# EAGLE design morse radio v1 (EAGLE 9.3.0)
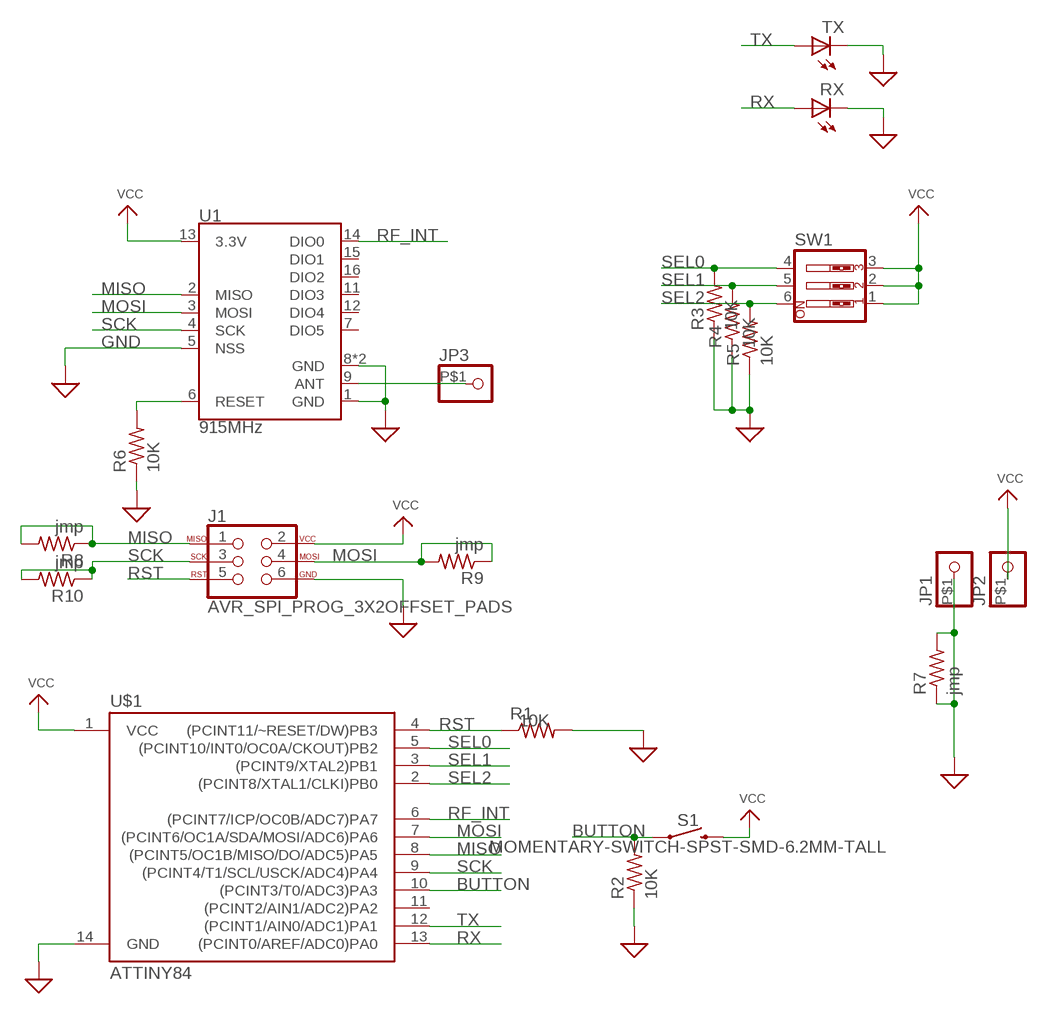
[diagram p0: schematic, sheet 1]

## Parts
J1  AVR_SPI_PROG_3X2OFFSET_PADS  [2X3_OFFSET]
JP1  PINHD-1X1-BIGPOGO  [1X1-BIGPOGO]
JP2  PINHD-1X1-BIGPOGO  [1X1-BIGPOGO]
JP3  PINHD-1X1-BIGPOGO  [1X1-BIGPOGO]
R1  10K  R-US_M1206  [M1206]
R2  10K  R-US_M1206  [M1206]
R3  10K  R-US_M1206  [M1206]
R4  10K  R-US_M1206  [M1206]
R5  10K  R-US_M1206  [M1206]
R6  10K  R-US_M1206  [M1206]
R7  jmp  R-US_M1206  [M1206]
R8  jmp  R-US_M1206  [M1206]
R9  jmp  R-US_M1206  [M1206]
R10  jmp  R-US_M1206  [M1206]
RX  LEDSMT1206  [1206]
S1  MOMENTARY-SWITCH-SPST-SMD-6.2MM-TALL  [TACTILE_SWITCH_SMD_6.2MM_TALL]
SW1  SW_DIP-3  [EDG-03]
TX  LEDSMT1206  [1206]
U1  915MHz  RFM69HCW-915  [RFM69HCW-XXXS2]
U$1  ATTINY84  [SO14]

## Nets
BUTTON: R2.2 S1.A2 U$1.10((PCINT3/T0/ADC3)PA3)
GND: J1.6 JP1.P$1 R1.2 R2.1 R3.1 R4.1 R5.1 R6.1 R7.1 R7.2 RX.C TX.C U1.1(GND) U1.5(NSS) U1.8(GND) U1.10(GND) U$1.14(GND) ; supply symbol labelled SUP
MISO: J1.1 R8.1 R8.2 U1.2(MISO) U$1.8((PCINT5/OC1B/MISO/DO/ADC5)PA5)
MOSI: J1.4 R9.1 R9.2 U1.3(MOSI) U$1.7((PCINT6/OC1A/SDA/MOSI/ADC6)PA6)
N$1: JP3.P$1 U1.9(ANT)
N$2: R6.2 U1.6(RESET)
RF_INT: U1.14(DIO0) U$1.6((PCINT7/ICP/OC0B/ADC7)PA7)
RST: J1.5 R1.1 U$1.4((PCINT11/~RESET/DW)PB3)
RX: RX.A U$1.13((PCINT0/AREF/ADC0)PA0)
SCK: J1.3 R10.1 R10.2 U1.4(SCK) U$1.9((PCINT4/T1/SCL/USCK/ADC4)PA4)
SEL0: R3.2 SW1.4 U$1.5((PCINT10/INT0/OC0A/CKOUT)PB2)
SEL1: R4.2 SW1.5 U$1.3((PCINT9/XTAL2)PB1)
SEL2: R5.2 SW1.6 U$1.2((PCINT8/XTAL1/CLKI)PB0)
TX: TX.A U$1.12((PCINT1/AIN0/ADC1)PA1)
VCC: J1.2 JP2.P$1 S1.B2 SW1.1 SW1.2 SW1.3 U1.13(3.3V) U$1.1(VCC)
Unconnected: U1.7(DIO5) U1.11(DIO3) U1.12(DIO4) U1.15(DIO1) U1.16(DIO2) U$1.11((PCINT2/AIN1/ADC2)PA2)

## Library data of the parts
J1 = SparkFun-Connectors:AVR_SPI_PROG_3X2: AVR ISP 6 Pin This is the reduced ISP connector for AVR programming. Common on Arduino. This footprint will take up less PCB space and can be used with a 10-pin to 6-pin adapter such as SKU: BOB-08508 **Special note about "TEST_POINT" package. The stop mask is on the top side, so if you want your programming test points to be on the bottom of your board, make sure to place this package on the bottom side of the board. This also ensure that the orientation to program from the bottom side will be correct. SparkFun Products: SparkFun ISP Pogo Adapter <https://www.sparkfun.com/products/11591> - NS Tiny AVR Programmer <https://www.sparkfun.com/products/11801> -PTH
JP1-JP3 = adafruit:PINHD-1X1: Pin header 1x1 for 0.1" spacing With round pins
R1-R10 = adafruit:R-US_: RESISTOR, American symbol
RX TX = adafruit:LED: LED OSRAM: - CHIPLED LG R971, LG N971, LY N971, LG Q971, LY Q971, LO R971, LY R971 LH N974, LH R974 LS Q976, LO Q976, LY Q976 LO Q996 - Hyper CHIPLED LW Q18S LB Q993, LB Q99A, LB R99A - SideLED LS A670, LO A670, LY A670, LG A670, LP A670 LB A673, LV A673, LT A673, LW A673 LH A674 LY A675 LS A676, LA A676, LO A676, LY A676, LW A676 LS A679, LY A679, LG A679 - Hyper Micro SIDELED® LS Y876, LA Y876, LO Y876, LY Y876 LT Y87S - SmartLED LW L88C, LW L88S LB L89C, LB L89S, LG L890 LS L89K, LO L89K, LY L89K LS L896, LA L896, LO L896, LY L896 - TOPLED LS T670, LO T670, LY T670, LG T670, LP T670 LSG T670, LSP T670, LSY T670, LOP T670, LYG T670 LG T671, LOG T671, LSG T671 LB T673, LV T673, LT T673, LW T673 LH T674 LS T676, LA T676, LO T676, LY T676, LB T676, LH T676, LSB T676, LW T676 LB T67C, LV T67C, LT T67C, LS T67K, LO T67K, LY T67K, LW E67C LS E67B, LA E67B, LO E67B, LY E67B, LB E67C, LV E67C, LT E67C LW T67C LS T679, LY T679, LG T679 LS T770, LO T770, LY T770, LG T770, LP T770 LB T773, LV T773, LT T773, LW T773 LH T774 LS E675, LA E675, LY E675, LS T675 LS T776, LA T776, LO T776, LY T776, LB T776 LHGB T686 LT T68C, LB T68C - Hyper Mini TOPLED® LB M676 - Mini TOPLED Santana® LG M470 LS M47K, LO M47K, LY M47K Source: http://www.osram.convergy.de/
S1 = SparkFun-Switches:MOMENTARY-SWITCH-SPST: Momentary Switch (Pushbutton) - SPST Normally-open (NO) SPST momentary switches (buttons, pushbuttons). Variants PTH-12MM - 12mm square, through-hole Momentary Pushbutton Switch - 12mm Square <https://www.sparkfun.com/products/9190> (COM-09190) PTH-6.0MM, PTH-6.0MM-KIT - 6.0mm square, through-hole Mini Pushbutton Switch <https://www.sparkfun.com/products/97> (COM-00097) KIT package intended for soldering kit's - only one side of pads' copper is exposed. PTH-RIGHT-ANGLE-KIT - Right-angle, through-hole Right Angle Tactile Button <https://www.sparkfun.com/products/10791> - Used on SparkFun BigTime Watch Kit <https://www.sparkfun.com/products/11734> SMD-12MM - 12mm square, surface-mount Tactile Button - SMD (12mm) <https://www.sparkfun.com/products/12993> (COM-12993) Used on SparkFun PicoBoard <https://www.sparkfun.com/products/11888> SMD-4.5MM - 4.5mm Square Trackball Switch Used on SparkFun Blackberry Trackballer Breakout <https://www.sparkfun.com/products/13169> SMD-4.6MMX2.8MM - 4.60mm x 2.80mm, surface mount Used on SparkFun SAMD21 Mini Breakout <https://www.sparkfun.com/products/13664> SMD-5.2MM, SMD-5.2-REDUNDANT - 5.2mm square, surface-mount Mini Pushbutton Switch - SMD <https://www.sparkfun.com/products/8720> (COM-08720) Used on Arduino Pro Mini <https://www.sparkfun.com/products/11114> REDUNDANT package connects both switch circuits together SMD-6.0X3.5MM - 6.0 x 3.5mm, surface mount Momentary Reset Switch SMD <https://www.sparkfun.com/products/8229> (COM-08229) SMD-6.2MM-TALL - 6.2mm square, surface mount Tactile Button - SMD (6mm) <https://www.sparkfun.com/products/12992> Used on SparkFun Digital Sandbox <https://www.sparkfun.com/products/12651> SMD-RIGHT-ANGLE - Right-angle, surface mount Used on SparkFun Block for Intel® Edison - Arduino <https://www.sparkfun.com/products/13036>; PROD_ID: SWCH-11966; SF_SKU: COM-12992
SW1 = special:SW_DIP-3: DIP SWITCH
U1 = SparkFun-RF:RFM69H: Hope RF RFM69H ISM Transceiver Module The RFM69H is a transceiver module capable of operation over a wide frequency range, including the 315,433,868 and 915MHz license-free ISM (Industry Scientific and Medical) frequency bands. All major RF communication parameters are programmable and most of them can be dynamically set. The RFM69H offers the unique advantage of programmable narrow-band and wide- band communication modes. The RFM69H is optimized for low power consumption while offering high RF output power and channelized operation.Compliance ETSI and FCC regulations. Datasheet <http://www.hoperf.cn/upload/docs/RF/SX/RFM69H_DataSheet_v1.3.pdf> SparkFun Products RFM69HCW Wireless Transceiver - 915MHz <https://www.sparkfun.com/products/13909> (COM-13909) RFM69HCW Wireless Transceiver - 434MHz <https://www.sparkfun.com/products/13910> (COM-13910) SparkFun RFM69 Breakout (915MHz) <https://www.sparkfun.com/products/12775> (WRL-12775) SparkFun RFM69 Breakout (434MHz) <https://www.sparkfun.com/products/12823> (WRL-12823); PROD_ID: IC-11997
U$1 = SparkFun-IC-Microcontroller:ATTINY84: Atmel 14-pin 2/4/8kB flash uC Datasheet <https://cdn.sparkfun.com/datasheets/Widgets/doc8006.pdf> SparkFun Products Tiny AVR Programmer <https://www.sparkfun.com/products/11801> (PGM-11801) SparkFun Servo Trigger - Continuous Rotation <https://www.sparkfun.com/products/13872> (WIG-13872) SparkFun Servo Trigger <https://www.sparkfun.com/products/13118> (WIG-13118); PROD_ID: IC-11285

## Board
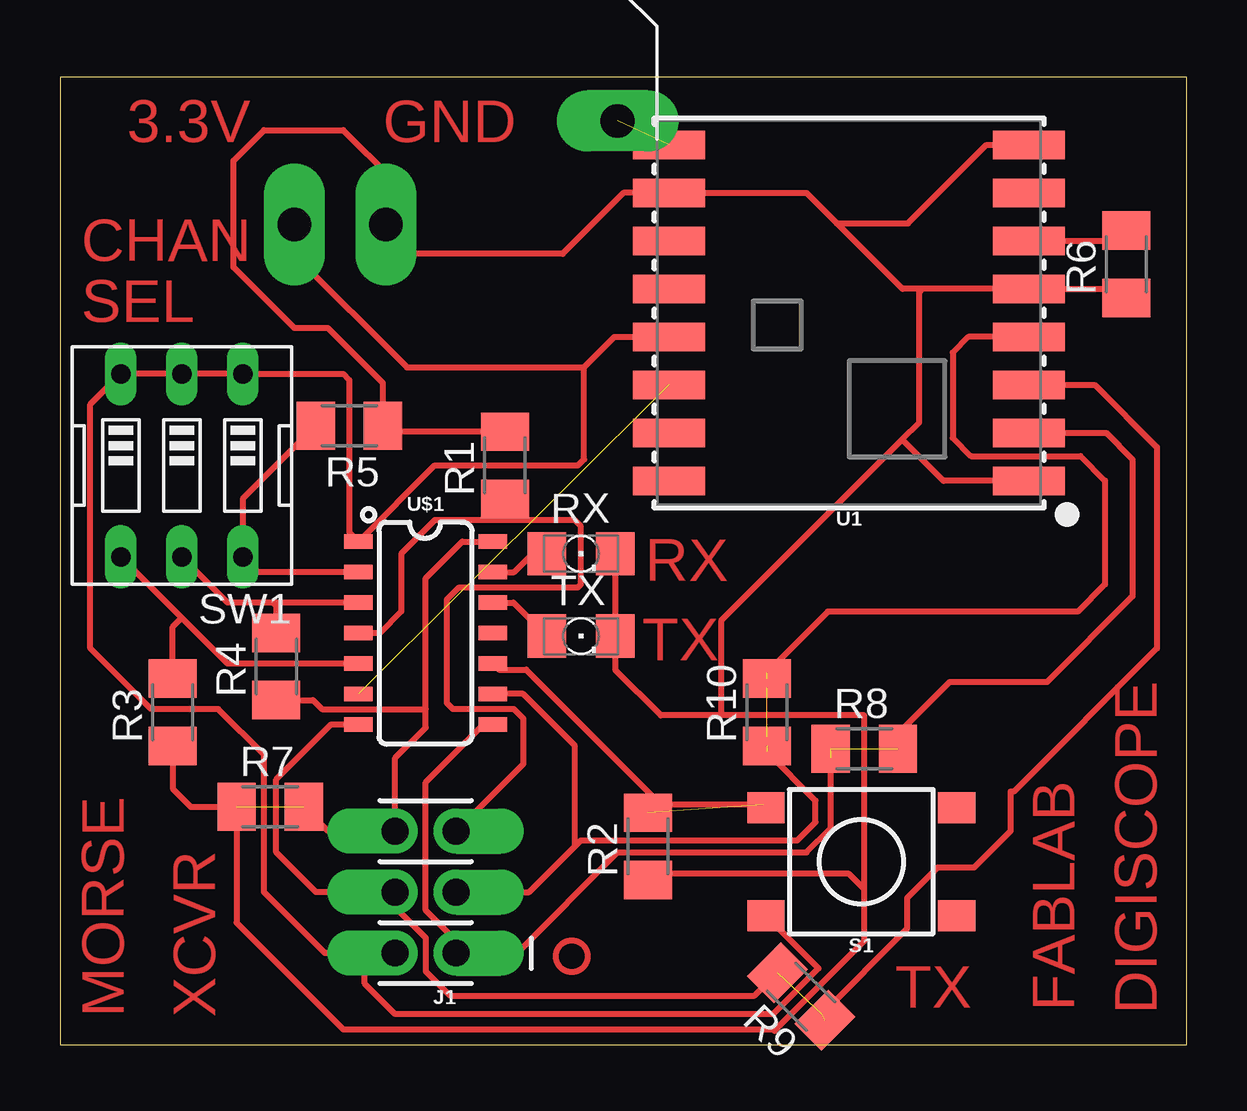
[diagram p1: board, top side]
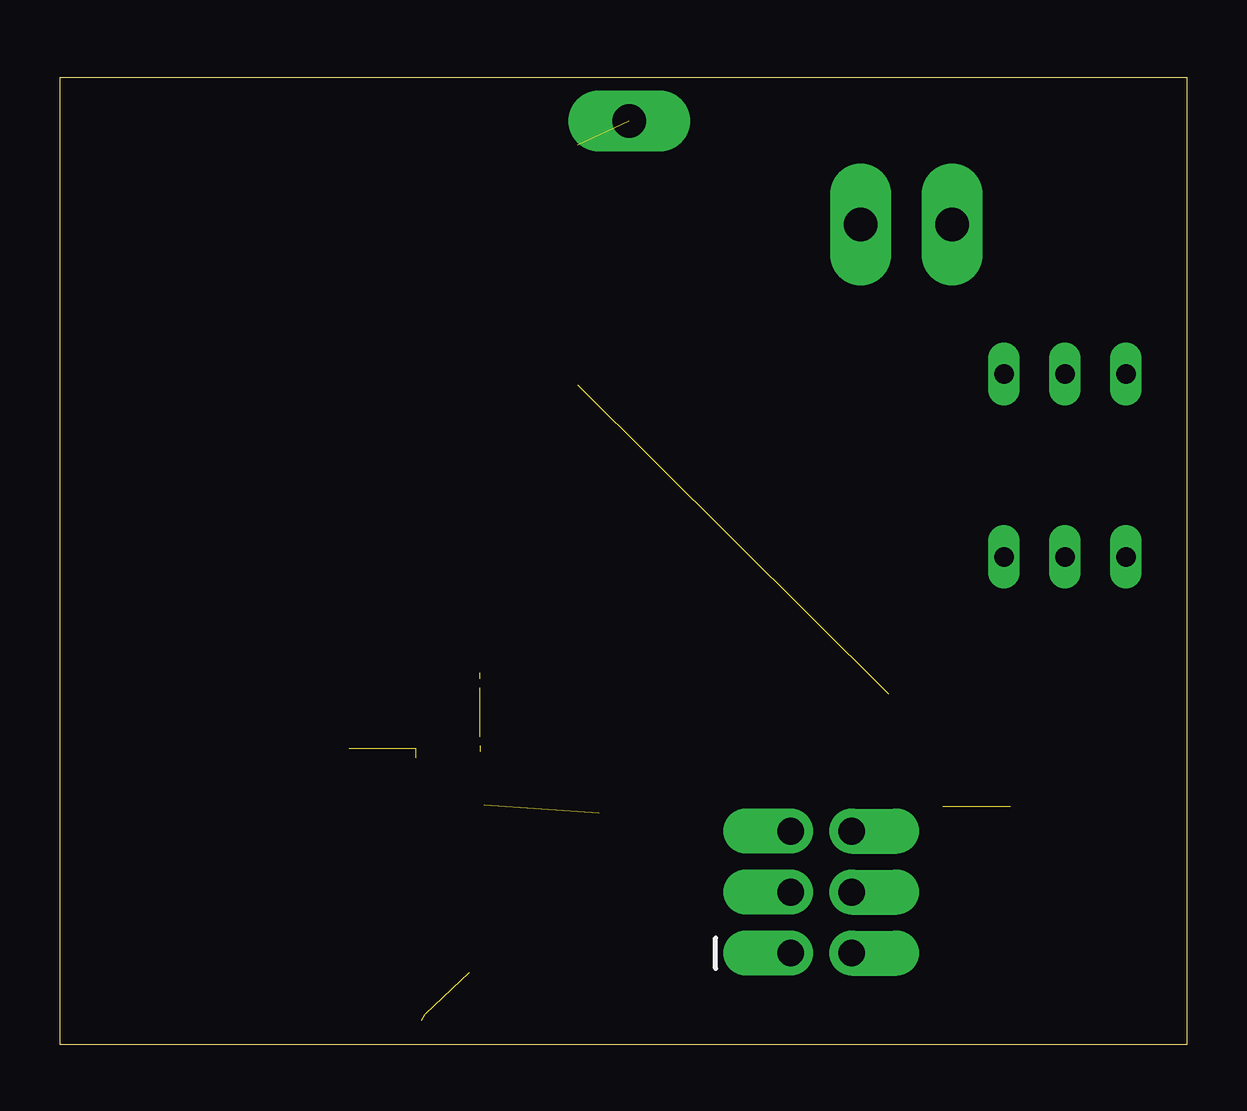
[diagram p2: board, bottom side, seen from below]

Size 46.97 x 40.31 mm. Coordinates in mm from the lower left corner, seen from the top.
Outline: 0,0 46.97,0 46.97,40.31 0,40.31 0,0
Copper layers (1*16): Top 0.035mm / dielectric 1.5mm / Bottom 0.035mm
Design rules "default *": minimum track width 10mil, minimum drill 0.35mm, track to track 6mil, track to pad 6mil, pad to pad 6mil, via to via 6mil, smd to smd 6mil, copper to edge 40mil, drill to drill 6mil, minimum pad ring 10mil, minimum via ring 8mil, stop-mask expansion 4mil, vias tented up to drill 0mil, thermal gap 10mil

### Footprints (pad centres in the part's own frame; a part is rotated, then mirrored left to right if it is on the bottom)
2X3_OFFSET = drill 1.118 pad 1.88 offset: 1 -2.54,-1.27; 2 -2.54,1.27; 3 0,-1.27; 4 0,1.27; 5 2.54,-1.27; 6 2.54,1.27
1X1-BIGPOGO = drill 1.4 pad 2.54 long: P$1 0,0
M1206 = smd 1.6 x 2: 1 -1.4,0; 2 1.4,0
1206 = smd 1.6 x 1.803: A -1.422,0; C 1.422,0
TACTILE_SWITCH_SMD_6.2MM_TALL = smd 1.55 x 1.3: A1 -3.975,-2.25; A2 3.975,-2.25; B1 -3.975,2.25; B2 3.975,2.25
EDG-03 = drill 0.813 long: 1 -2.54,-3.81; 2 0,-3.81; 3 2.54,-3.81; 4 2.54,3.81; 5 0,3.81; 6 -2.54,3.81
RFM69HCW-XXXS2 = smd 3 x 1.2: 1 -7.5,7; 2 -7.5,5; 3 -7.5,3; 4 -7.5,1; 5 -7.5,-1; 6 -7.5,-3; 7 -7.5,-5; 8 -7.5,-7; 9 7.5,-7; 10 7.5,-5; 11 7.5,-3; 12 7.5,-1; 13 7.5,1; 14 7.5,3; 15 7.5,5; 16 7.5,7
SO14 = smd 0.6 x 1.2: 1 -3.175,-2.8; 2 -1.905,-2.8; 3 -0.635,-2.8; 4 0.635,-2.8; 5 1.905,-2.8; 6 3.175,-2.8; 7 4.445,-2.8; 8 4.445,2.8; 9 3.175,2.8; 10 1.905,2.8; 11 0.635,2.8; 12 -0.635,2.8; 13 -1.905,2.8; 14 -3.175,2.8

### Placement (x,y rotation side)
J1  15.24,6.35 90 top
JP1  13.59,34.16 90 top
JP2  9.78,34.16 90 top
JP3  23.24,38.48 180 top
R1  18.54,24.13 90 top
R2  24.51,8.25 90 top
R3  4.7,13.84 90 top
R4  9.02,15.75 90 top
R5  12.07,25.78 180 top
R6  44.45,32.51 90 top
R7  8.76,9.91 0 top
R8  33.53,12.32 0 top
R9  30.9,1.99 135 top
R10  29.46,13.84 90 top
RX  21.72,20.45 0 top
S1  33.4,7.62 180 top
SW1  5.08,24.13 180 top
TX  21.72,17.02 0 top
U1  32.89,30.48 180 top
U$1  15.24,17.78 270 top

### Tracks (layer width: path | path; a pad name or v marks a point on that pad's centre or on a via)
BUTTON  (1 unrouted)
  Top 0.254: U$1.10 18.29,15.62 19.43,15.62 25.06,10 29.3,10 S1.A2
GND  (1 unrouted)
  Top 0.254: U$1.14 16.76,20.95 15.24,19.43 15.24,13.97 | 15.24,13.97 15.24,13.21 13.97,11.94 J1.6 11.18,8.89 R7.2 | RX.C TX.C 23.14,15.62 25.04,13.72 27.56,13.72 | 32.39,34.21 35.35,34.21 38.62,37.48 U1.8 | 35.94,31.48 U1.5 44.08,31.48 R6.1 | 35.94,31.48 35.12,31.48 32.39,34.21 | U1.1 36.83,23.48 35.12,25.2 35.12,25.21 | 13.72,34.21 14.48,34.21 13.21,32.94 20.95,32.94 23.49,35.48 U1.10 31.12,35.48 32.39,34.21 | 13.72,34.21 13.64,34.21 JP1.P$1 | 33.53,6.48 33.53,4.32 29.78,0.57 29.72,0.64 11.81,0.64 7.36,5.08 R7.1 5.46,9.91 4.7,10.67 R3.1 | 33.53,6.48 32.89,7.11 24.77,7.11 R2.1 | 27.56,13.72 33.53,13.72 33.53,6.48 | 35.12,25.21 27.56,17.65 27.56,13.72 | 35.12,25.21 35.81,25.91 35.81,31.35 35.94,31.48 | R4.1 10.54,14.35 10.92,13.97 15.24,13.97 | 13.72,34.21 13.84,34.34 13.84,36.07 11.81,38.1 8.51,38.1 7.24,36.83 7.24,32.39 9.78,29.84 11.18,29.84 13.47,27.56 R5.1 13.72,25.53 R1.2
MISO  (2 unrouted)
  Top 0.254: U$1.8 17.65,13.34 15.24,10.92 15.24,5.59 16.51,4.32 J1.1 19.05,3.81 23.24,8 31.12,8 32.13,9.02 32.13,11.94 | U1.2 43.61,25.48 44.7,24.38 44.7,18.67 41.15,15.11 37.08,15.11 34.93,12.96 R8.2
MOSI  (2 unrouted)
  Top 0.254: U$1.7 11.3,13.34 9.02,11.05 9.02,8 10.67,6.35 J1.4 13.97,5.72 15.24,4.45 15.24,3.05 16.26,2.03 28.95,2.03 R9.2 | U1.3 43.13,27.48 45.72,24.89 45.72,16.51 39.75,10.54 39.62,10.54 39.62,8.89 38.1,7.37 36.58,7.37 35.31,6.1 35.31,4.83 31.75,1.27
N$1  (1 unrouted)
N$2
  Top 0.254: U1.6 44.02,33.48 R6.2
RF_INT  (1 unrouted)
RST
  Top 0.254: 19.05,21.84 21.46,21.84 21.72,21.59 21.72,19.18 21.59,19.05 16.64,19.05 16.13,18.54 16.13,14.22 16.38,13.97 18.92,13.97 19.3,13.59 19.3,11.68 J1.5 | 19.05,21.84 15.62,21.84 14.22,20.45 14.22,18.03 13.34,17.14 U$1.4 | R1.1 18.54,22.35 19.05,21.84
RX
  Top 0.254: RX.A 19.69,20.45 18.93,19.69 U$1.13
SCK  (3 unrouted)
  Top 0.254: J1.3 19.56,6.35 21.46,8.25 | 21.46,8.25 21.46,12.45 19.3,14.61 U$1.9 | 21.46,8.25 21.72,8.51 30.73,8.51 31.5,9.27 31.5,10.16 29.46,12.19 29.46,12.83 | U1.4 37.86,29.48 37.21,28.83 37.21,25.27 37.97,24.51 42.55,24.51 43.56,23.5 43.56,19.18 42.42,18.03 32,18.03 29.46,15.49 29.46,14.86
SEL0
  Top 0.254: U$1.5 6.98,15.88 5.08,17.78 | 5.08,17.78 SW1.4 | R3.2 4.7,17.4 5.08,17.78
SEL1
  Top 0.254: U$1.3 8.89,18.42 | 8.89,18.42 6.98,18.42 SW1.5 | 8.89,18.42 9.02,18.29 R4.2
SEL2
  Top 0.254: U$1.2 8.26,19.69 SW1.6 7.62,22.74 R5.2
TX
  Top 0.254: U$1.12 18.9,18.42 TX.A
VCC
  Top 0.254: J1.2 12.7,3.81 | 12.7,3.81 11.05,3.81 8.51,6.35 8.51,12.06 6.6,13.97 3.81,13.97 1.27,16.51 1.27,26.67 SW1.3 SW1.2 SW1.1 11.8,27.94 12.06,27.69 12.06,21.34 U$1.1 | JP2.P$1 9.78,32.89 14.46,28.21 21.84,28.21 23.11,29.48 U1.13 | U$1.1 15.62,24.13 21.59,24.13 21.84,24.38 21.84,28.21 | S1.B2 31.62,3.17 29.72,1.27 13.97,1.27 12.7,2.54 12.7,3.81 | 12.07,20.95 U$1.1
(copper drawn outside any net)
  shapes: Top circle x1

### Text on the board
Top: 3.3V | GND | CHAN | SEL | RX | TX | MORSE | XCVR | TX | FABLAB | DIGISCOPE